# EAGLE schematic ais_rx1_v1 (EAGLE 7.3.0)
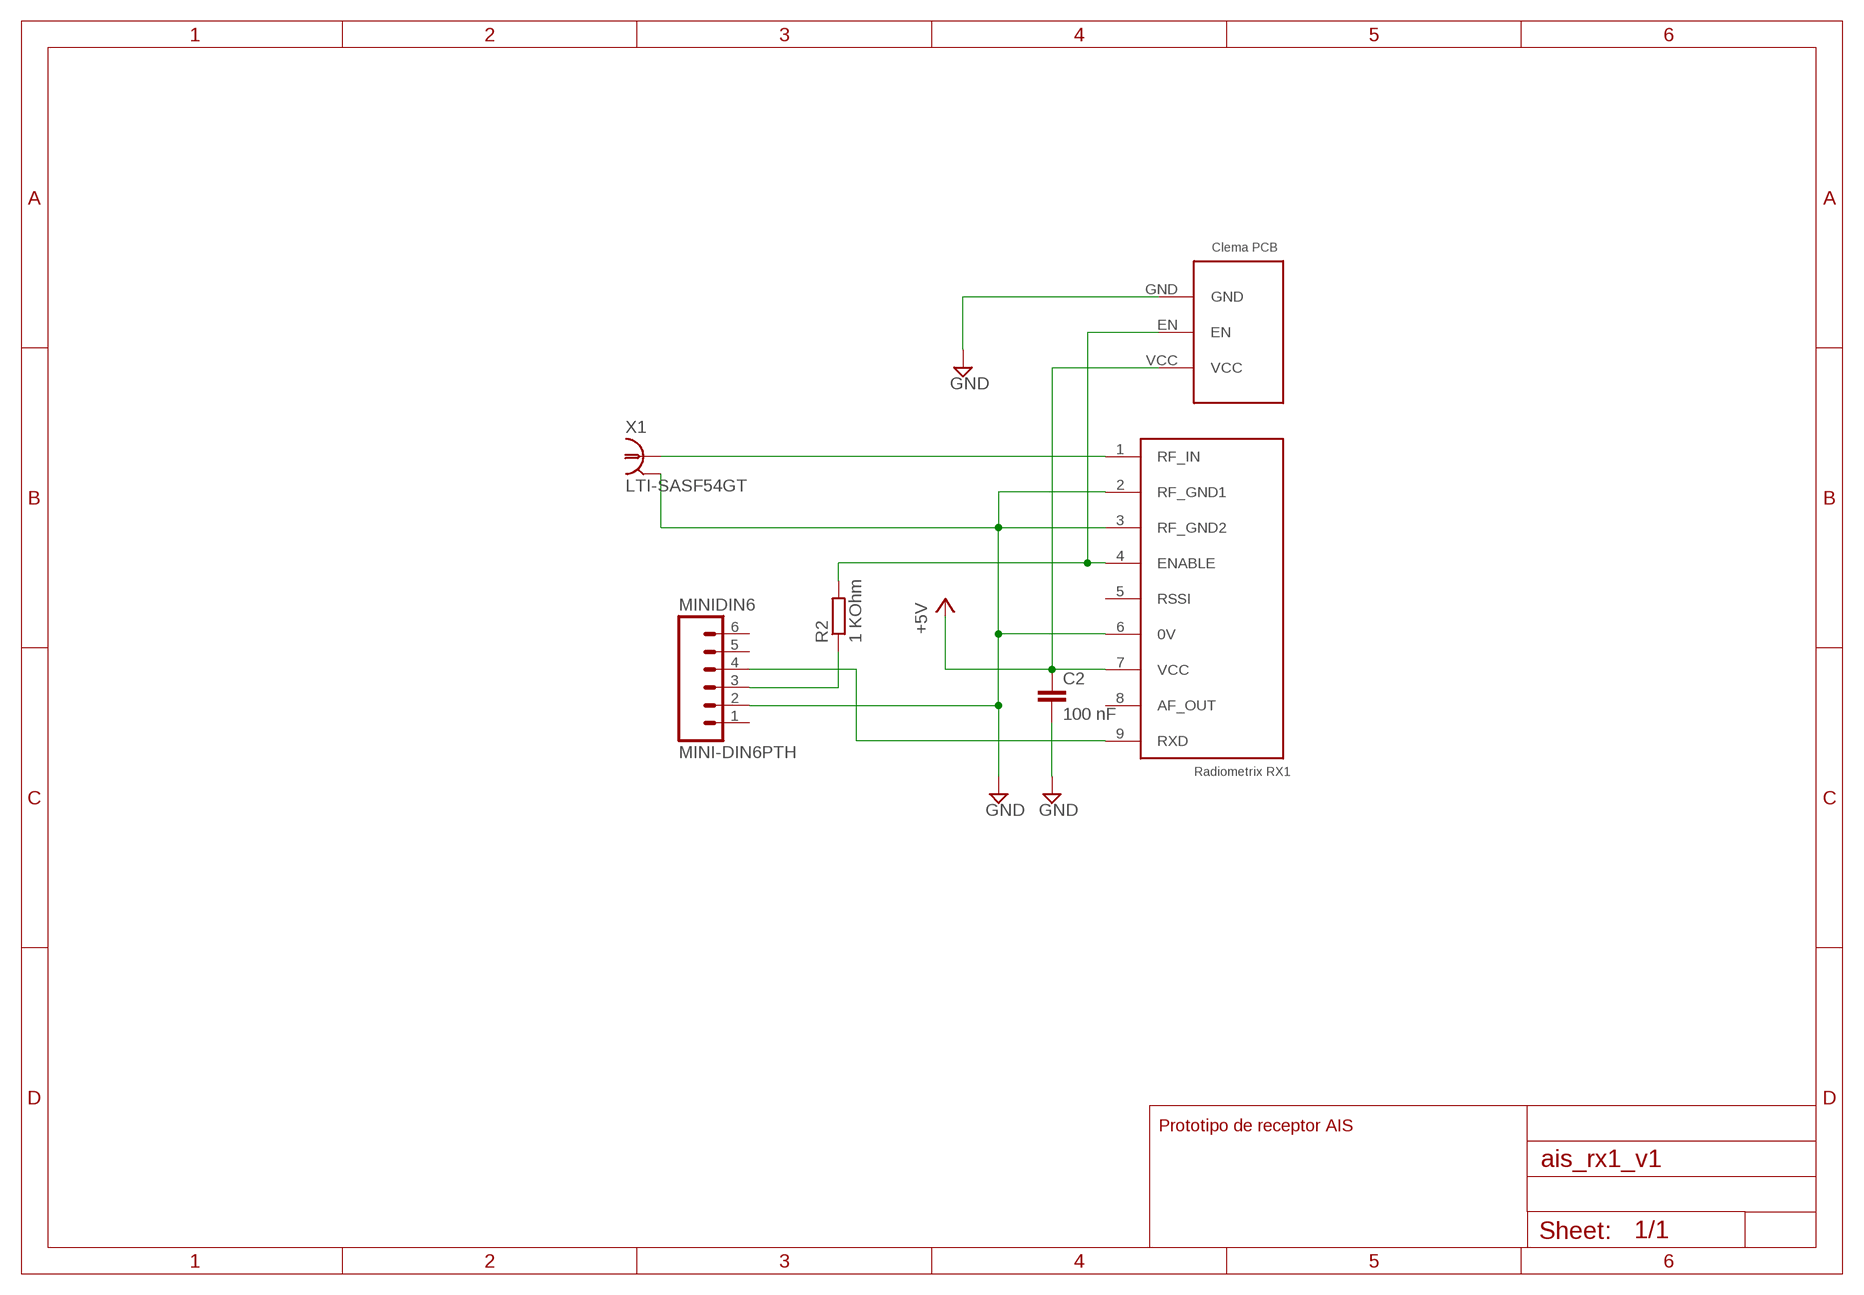
[diagram p0: schematic, sheet 1]

## Parts
C2  100 nF  C-EUC0805  [C0805]
CLEMAPCB1  CLEMA  [CLEMA]
MINIDIN6  MINI-DIN6PTH  [MINI-DIN6]
R2  1 KOhm  R-EU_R0805  [R0805]
RX1  RX1  [RX1]
X1  LTI-SASF54GT  [LTI-SASF54GT]

## Nets
+5V: C2.1 CLEMAPCB1.VCC RX1.7(VCC)
GND: C2.2 CLEMAPCB1.GND MINIDIN6.2 RX1.2(RF_GND1) RX1.3(RF_GND2) RX1.6(0V) X1.2 X1.3 X1.4 X1.5
N$2: RX1.1(RF_IN) X1.1
N$3: CLEMAPCB1.EN R2.2 RX1.4(ENABLE)
N$5: MINIDIN6.4 RX1.9(RXD)
N$7: MINIDIN6.3 R2.1
Unconnected: MINIDIN6.1 MINIDIN6.5 MINIDIN6.6 RX1.8(AF_OUT)

## Notes on the sheet
- Prototipo de receptor AIS

## Power pins joined to a net without a drawn wire
RSSI: RX1.5(RSSI)

## Library data of the parts
C2 = rcl:C-EU: CAPACITOR, European symbol
CLEMAPCB1 = clema_pcb:CLEMA
MINIDIN6 = SparkFun-Connectors:MINI-DIN6: mini DIN 6 Connector Commonly found on the back of a computer for PS2 keyboard and mice. Schematic and footprint are proven. Spark Fun Electronics SKU : PRT-08509
R2 = resistor:R-EU_: RESISTOR, European symbol
RX1 = radiometrix_rx1:RX1
X1 = con-coax:LTI-SASF54GT: SMA vertical PCB thrue hole jack Source: Lighthorse Technologies, inc. SASF54GT.pdf; OC_FARNELL: unknown; OC_NEWARK: unknown